# Altium schematic sheet Digital_Inputs.SchDoc
size A4
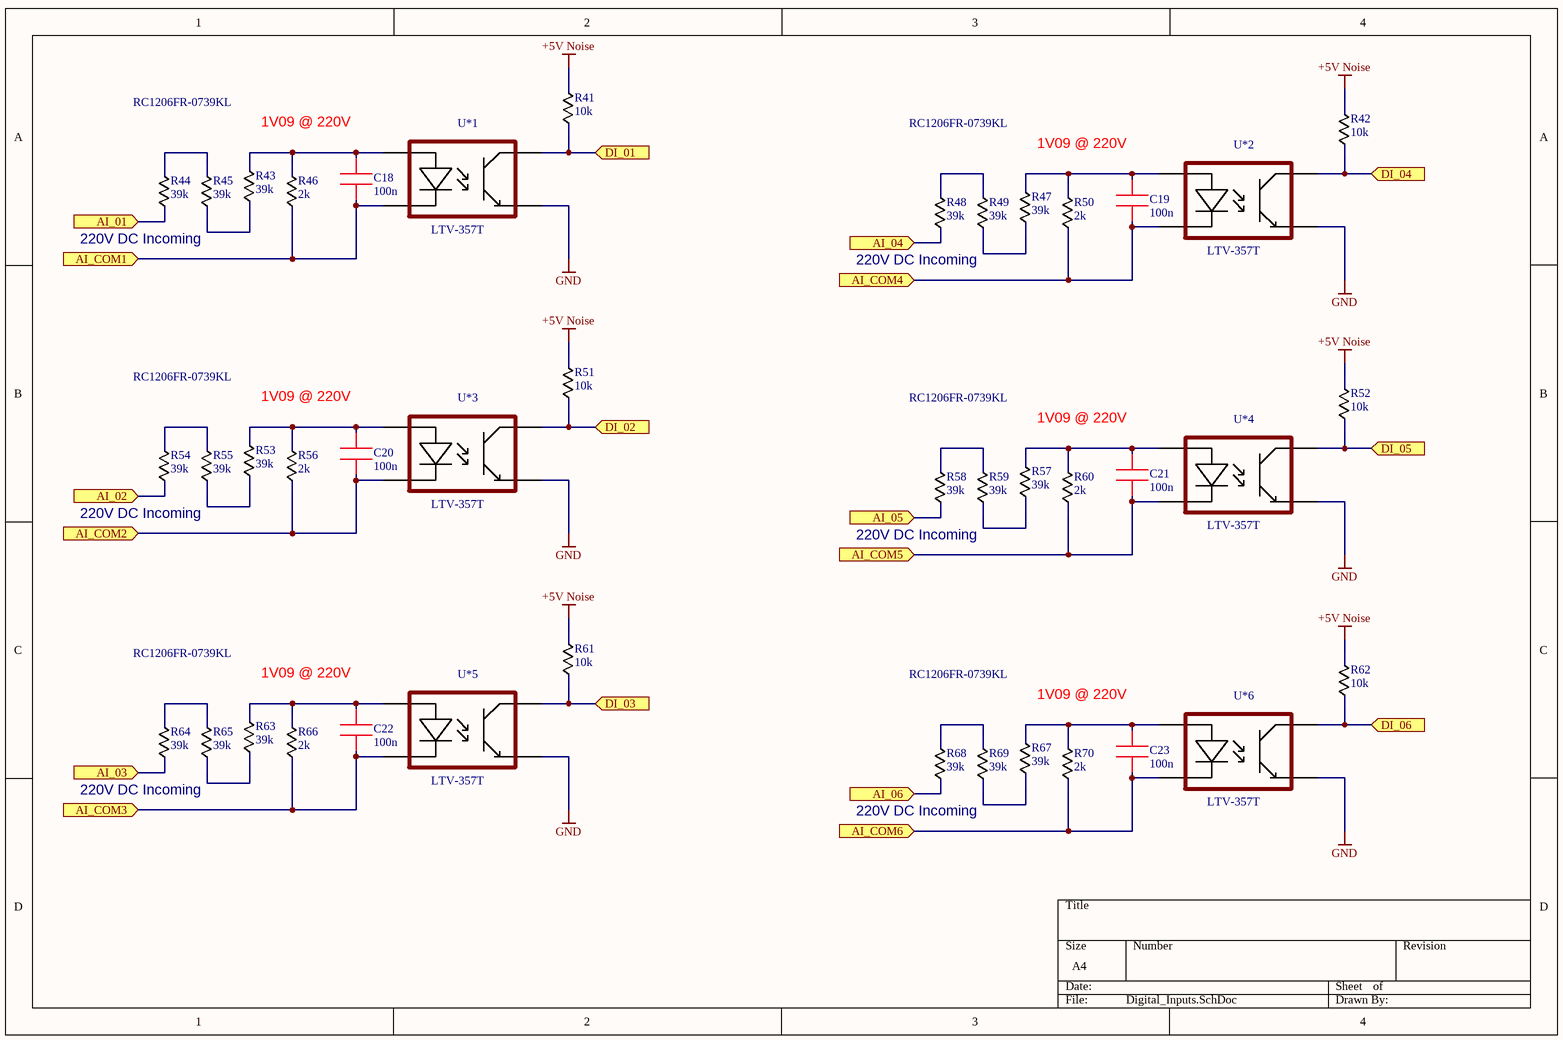
[diagram p0: Digital_Inputs.SchDoc]

## Parts
C18  100n  [0603]
C19  100n  [0603]
C20  100n  [0603]
C21  100n  [0603]
C22  100n  [0603]
C23  100n  [0603]
R41  10k  [0603]
R42  10k  [0603]
R43  39k  [1206]
R44  39k  [1206]
R45  39k  [1206]
R46  2k  [1206]
R47  39k  [1206]
R48  39k  [1206]
R49  39k  [1206]
R50  2k  [1206]
R51  10k  [0603]
R52  10k  [0603]
R53  39k  [1206]
R54  39k  [1206]
R55  39k  [1206]
R56  2k  [1206]
R57  39k  [1206]
R58  39k  [1206]
R59  39k  [1206]
R60  2k  [1206]
R61  10k  [0603]
R62  10k  [0603]
R63  39k  [1206]
R64  39k  [1206]
R65  39k  [1206]
R66  2k  [1206]
R67  39k  [1206]
R68  39k  [1206]
R69  39k  [1206]
R70  2k  [1206]
U*1  LTV-357T  [SOP-4]
U*2  LTV-357T  [SOP-4]
U*3  LTV-357T  [SOP-4]
U*4  LTV-357T  [SOP-4]
U*5  LTV-357T  [SOP-4]
U*6  LTV-357T  [SOP-4]

## Ports
AI_01, AI_02, AI_03, AI_04, AI_05, AI_06, AI_COM1, AI_COM2, AI_COM3, AI_COM4, AI_COM5, AI_COM6, DI_01, DI_02, DI_03, DI_04, DI_05, DI_06

## Nets
+5V Noise: R41.2 R42.2 R51.2 R52.2 R61.2 R62.2
GND: U*1.Emmiter(E) U*2.Emmiter(E) U*3.Emmiter(E) U*4.Emmiter(E) U*5.Emmiter(E) U*6.Emmiter(E)
AI_01: R44.1 ; port AI_01
AI_02: R54.1 ; port AI_02
AI_03: R64.1 ; port AI_03
AI_04: R48.1 ; port AI_04
AI_05: R58.1 ; port AI_05
AI_06: R68.1 ; port AI_06
AI_COM1: C18.1 R46.1 U*1.Cathode(C) ; port AI_COM1
AI_COM2: C20.1 R56.1 U*3.Cathode(C) ; port AI_COM2
AI_COM3: C22.1 R66.1 U*5.Cathode(C) ; port AI_COM3
AI_COM4: C19.1 R50.1 U*2.Cathode(C) ; port AI_COM4
AI_COM5: C21.1 R60.1 U*4.Cathode(C) ; port AI_COM5
AI_COM6: C23.1 R70.1 U*6.Cathode(C) ; port AI_COM6
DI_01: R41.1 U*1.Collector(C) ; port DI_01
DI_02: R51.1 U*3.Collector(C) ; port DI_02
DI_03: R61.1 U*5.Collector(C) ; port DI_03
DI_04: R42.1 U*2.Collector(C) ; port DI_04
DI_05: R52.1 U*4.Collector(C) ; port DI_05
DI_06: R62.1 U*6.Collector(C) ; port DI_06
NetC18_2: C18.2 R43.2 R46.2 U*1.Anode(A)
NetC19_2: C19.2 R47.2 R50.2 U*2.Anode(A)
NetC20_2: C20.2 R53.2 R56.2 U*3.Anode(A)
NetC21_2: C21.2 R57.2 R60.2 U*4.Anode(A)
NetC22_2: C22.2 R63.2 R66.2 U*5.Anode(A)
NetC23_2: C23.2 R67.2 R70.2 U*6.Anode(A)
NetR43_1: R43.1 R45.1
NetR44_2: R44.2 R45.2
NetR47_1: R47.1 R49.1
NetR48_2: R48.2 R49.2
NetR53_1: R53.1 R55.1
NetR54_2: R54.2 R55.2
NetR57_1: R57.1 R59.1
NetR58_2: R58.2 R59.2
NetR63_1: R63.1 R65.1
NetR64_2: R64.2 R65.2
NetR67_1: R67.1 R69.1
NetR68_2: R68.2 R69.2

## Notes on the sheet
- RC1206FR-0739KL
- 1V09 @ 220V
- 220V DC Incoming

## Library data of the parts
C18-C23 = 0603 CAP: CC0603KRX7R9BB104
R41 R42 R51 R52 R61 R62 = 0603 RES: RT0603FRE0710KL
R43-R45 R47-R49 R53-R55 R57-R59 R63-R65 R67-R69 = 1206 R: RC1206FR-0739KL
R46 R50 R56 R60 R66 R70 = 1206 R: RC1206FR-072KL
U*1-U*6 = LTV-357T: pin to pad: Anode>1 Cathode>2 Collector>4 Emmiter>3